# Altium project Sensor.PrjPcb
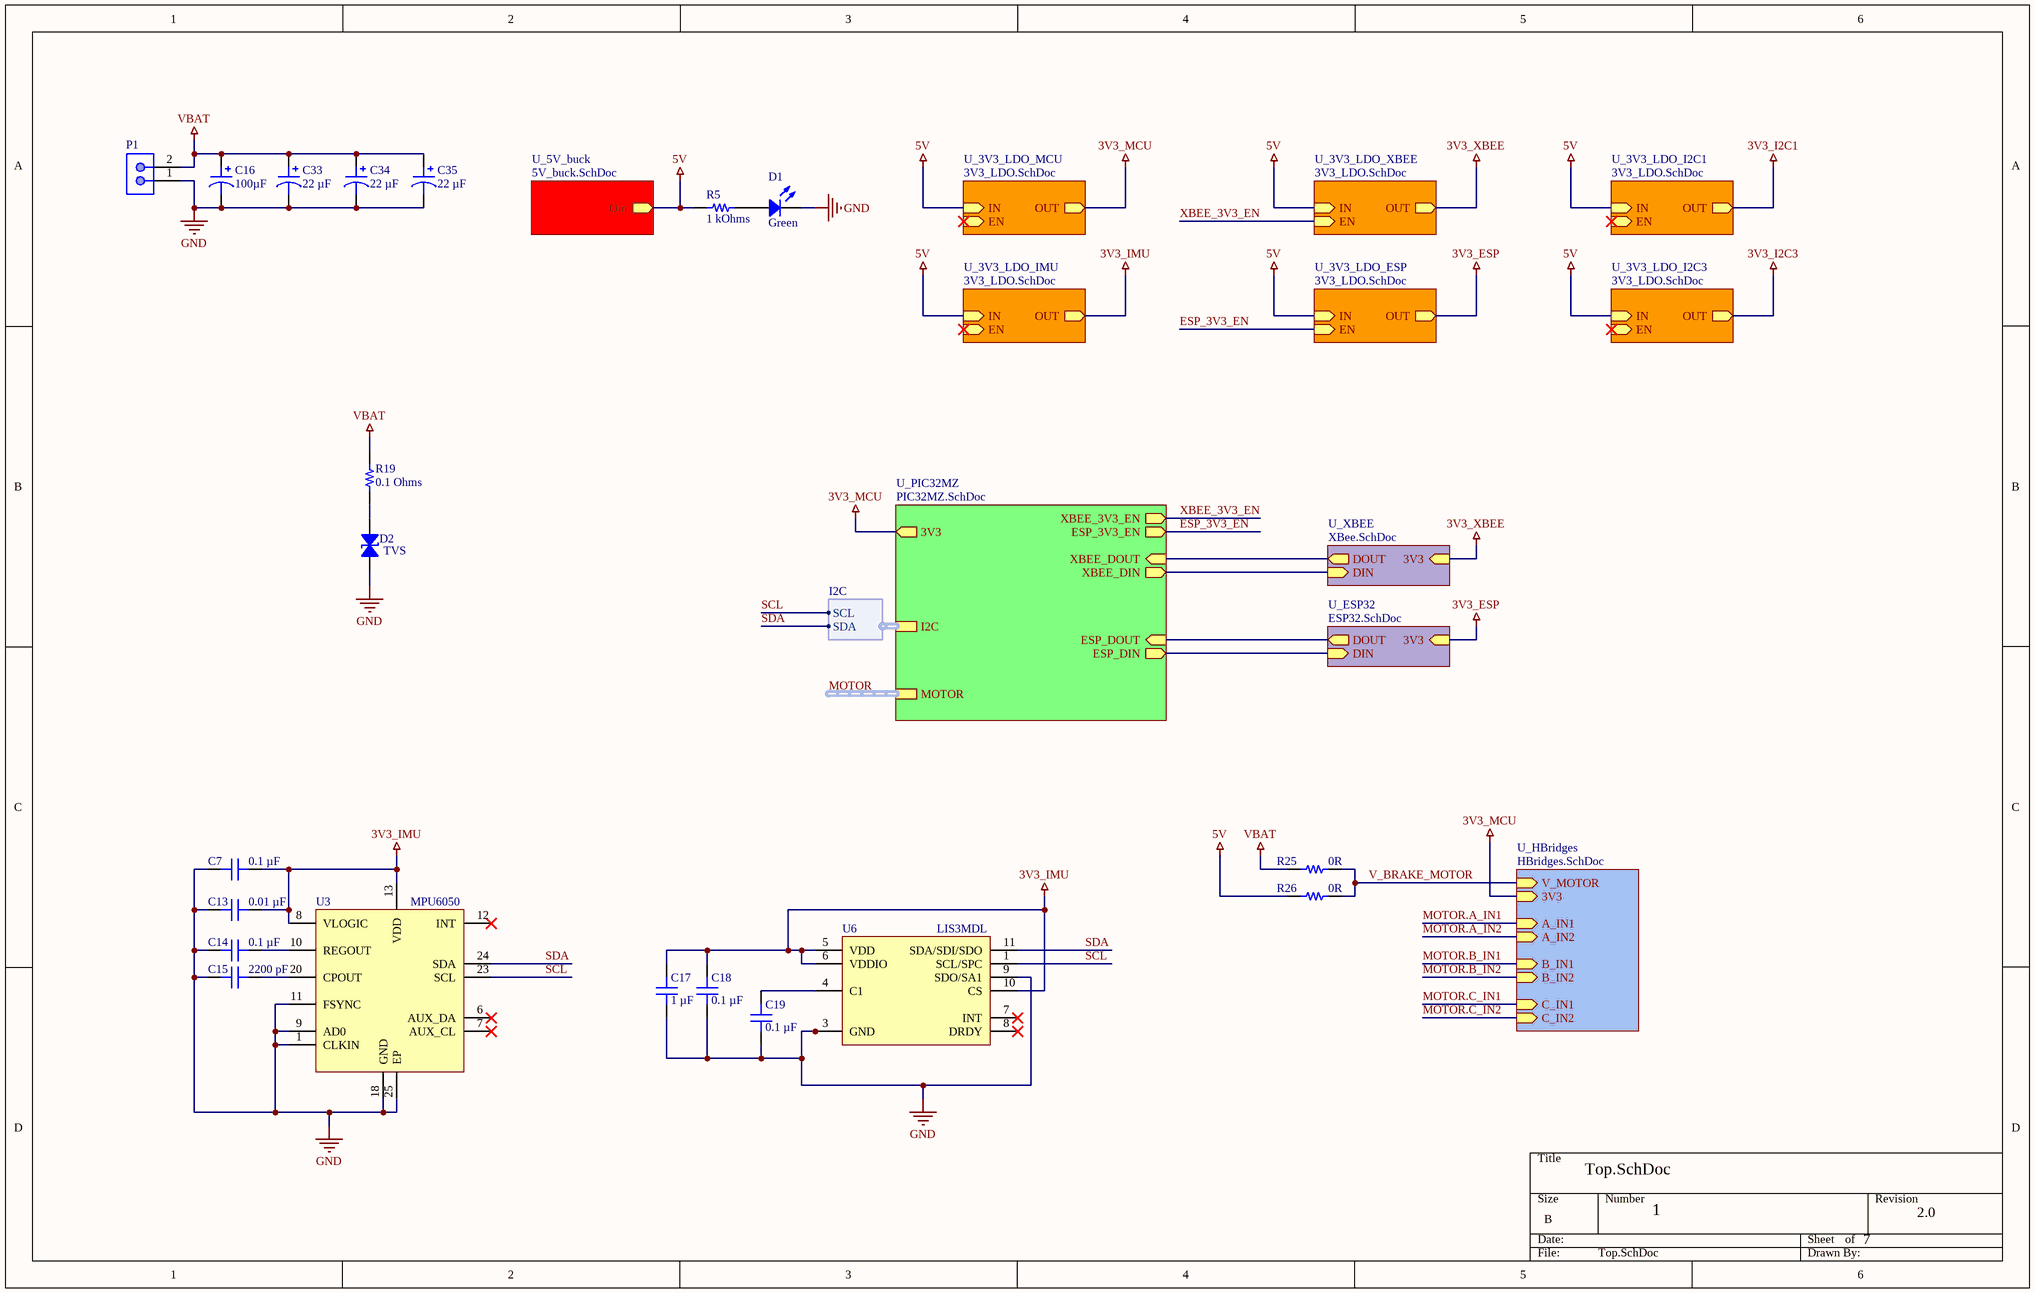
[diagram p0: Top.SchDoc]
ProjectRevision: 2.0
4 sheets, 44 parts. Net scope: hierarchical (ports join the sheet entries above them; power ports are global).
Board file: Sensor.PcbDoc
Sheets:
  Top.SchDoc
    U_5V_buck = 5V_buck.SchDoc
    U_HBridges = HBridges.SchDoc
    U_XBEE = XBee.SchDoc

## Sheet Top.SchDoc
size B; DocumentNumber: 1; SheetNumber: 1; SheetTotal: 7

### Parts
C7  0.1 µF  [CAP 0402_1005]
C13  0.01 µF  [CAP 0402_1005]
C14  0.1 µF  [CAP 0402_1005]
C15  2200 pF  [CAP 0402_1005]
C16  100µF  [CAP POL 2917_7343]
C17  1 µF  [CAP 0402_1005]
C18  0.1 µF  [CAP 0402_1005]
C19  0.1 µF  [CAP 0402_1005]
C33  22 µF  [CAP ALSMD 5.3MM H5.4MM]
C34  22 µF  [CAP ALSMD 5.3MM H5.4MM]
C35  22 µF  [CAP ALSMD 5.3MM H5.4MM]
D1  Green  [LED 0603_1608 GREEN]
D2  TVS  [DO214AC SMA]
P1  2 pin 2mm JST Male  [2pin - 2mm JST male]  (value not drawn)
R5  1 kOhms  [YAGEO RES 0402_1005]
R19  0.1 Ohms  [RES 1206_3216]
R25  0R  [RES 0603_1608]
R26  0R  [RES 0603_1608]
U3  MPU6050  [IC_MPU6050]
U6  LIS3MDL  [LGA12_ST]

### Sub-sheets
U_3V3_LDO_ESP = 3V3_LDO.SchDoc (file not in this document): OUT (out), IN (in), EN (in)
U_3V3_LDO_I2C1 = 3V3_LDO.SchDoc (file not in this document): OUT (out), IN (in), EN (in)
U_3V3_LDO_I2C3 = 3V3_LDO.SchDoc (file not in this document): OUT (out), IN (in), EN (in)
U_3V3_LDO_IMU = 3V3_LDO.SchDoc (file not in this document): OUT (out), IN (in), EN (in)
U_3V3_LDO_MCU = 3V3_LDO.SchDoc (file not in this document): OUT (out), IN (in), EN (in)
U_3V3_LDO_XBEE = 3V3_LDO.SchDoc (file not in this document): OUT (out), IN (in), EN (in)
U_5V_buck = 5V_buck.SchDoc: Out (out)
U_ESP32 = ESP32.SchDoc (file not in this document): 3V3 (in), DOUT (out), DIN (in)
U_HBridges = HBridges.SchDoc: A_IN1 (in), A_IN2 (in), B_IN1 (in), B_IN2 (in), C_IN1 (in), C_IN2 (in), 3V3 (in), V_MOTOR (in)
U_PIC32MZ = PIC32MZ.SchDoc (file not in this document): XBEE_DIN (out), XBEE_DOUT (in), I2C (harness I2C), MOTOR (harness MOTOR), ESP_DIN (out), ESP_DOUT (in), XBEE_3V3_EN (out), ESP_3V3_EN (out), 3V3 (out)
U_XBEE = XBee.SchDoc: 3V3 (in), DOUT (out), DIN (in)

### Harnesses
I2C: SCL, SDA

### Nets
3V3_ESP: sheet U_3V3_LDO_ESP/OUT, sheet U_ESP32/3V3
3V3_I2C1: sheet U_3V3_LDO_I2C1/OUT
3V3_I2C3: sheet U_3V3_LDO_I2C3/OUT
3V3_IMU: C7.1 C13.1 C17.1 C18.1 U3.8(VLOGIC) U3.13(VDD) U6.5(VDD) U6.6(VDDIO) U6.10(CS) ; sheet U_3V3_LDO_IMU/OUT
3V3_MCU: sheet U_PIC32MZ/3V3, sheet U_3V3_LDO_MCU/OUT, sheet U_HBridges/3V3
3V3_XBEE: sheet U_3V3_LDO_XBEE/OUT, sheet U_XBEE/3V3
5V: R5.1 R26.1 ; sheet U_5V_buck/Out, sheet U_3V3_LDO_MCU/IN, sheet U_3V3_LDO_XBEE/IN, sheet U_3V3_LDO_IMU/IN, sheet U_3V3_LDO_ESP/IN, sheet U_3V3_LDO_I2C1/IN, sheet U_3V3_LDO_I2C3/IN
GND: C7.2 C13.2 C14.2 C15.2 C16.2 C17.2 C18.2 C19.2 C33.2 C34.2 C35.2 D1.2 D2.2 P1.1 U3.1(CLKIN) U3.9(AD0) U3.11(FSYNC) U3.18(GND) U3.25(EP) U6.2(Reserved) U6.3(GND) U6.9(SDO/SA1) U6.12(Reserved)
VBAT: C16.1 C33.1 C34.1 C35.1 P1.2 R19.2 R25.1
ESP_3V3_EN: sheet U_PIC32MZ/ESP_3V3_EN, sheet U_3V3_LDO_ESP/EN
SCL: U3.23(SCL) U6.1(SCL/SPC) ; sheet U_PIC32MZ/I2C.SCL
SDA: U3.24(SDA) U6.11(SDA/SDI/SDO) ; sheet U_PIC32MZ/I2C.SDA
V_BRAKE_MOTOR: R25.2 R26.2 ; sheet U_HBridges/V_MOTOR
XBEE_3V3_EN: sheet U_PIC32MZ/XBEE_3V3_EN, sheet U_3V3_LDO_XBEE/EN
XBEE_DIN: sheet U_PIC32MZ/XBEE_DIN, sheet U_XBEE/DIN
XBEE_DOUT: sheet U_PIC32MZ/XBEE_DOUT, sheet U_XBEE/DOUT
NetC14_1: C14.1 U3.10(REGOUT)
NetC15_1: C15.1 U3.20(CPOUT)
NetC19_1: C19.1 U6.4(C1)
NetD1_1: D1.1 R5.2
NetD2_1: D2.1 R19.1
(unnamed): sheet U_PIC32MZ/ESP_DIN, sheet U_ESP32/DIN
(unnamed): sheet U_PIC32MZ/ESP_DOUT, sheet U_ESP32/DOUT

Not connected (* = marked no-connect by the designer): U3 6(AUX_DA)* 7(AUX_CL)* 12(INT)*; U6 7(INT)* 8(DRDY)*

### Buses and harness runs
harness MOTOR = sheet U_PIC32MZ/MOTOR

### Library data of the parts
C7 C14 C18 C19 = C0402C104K4RACAUTO: CAP CER 0.1UF 16V X7R 0402; manufacturer: KEMET; Tolerance: ±10%; Part Number: C0402C104K4RACAUTO; Value: 0.1 µF; Applications: Automotive, Bypass, Decoupling; Capacitance: 0.1 µF; componentlink1description: Datasheet; componentlink1url: https://api.kemet.com/component-edge/download/specsheet/C0402C104K4RACAUTO.pdf; componentlink2description: DigiKey Link; componentlink2url: https://www.digikey.com/en/products/detail/kemet/C0402C104K4RACAUTO/3314827; Device Package: 0402 (1005 Metric); lastupdated: 8/14/2022 9:05:51 PM; Lifecycle Status: Active; Minimum Order: 1; Mounting Type: Surface Mount, MLCC; Operating Temperature: -55°C ~ 125°C; Package / Case: 0402 (1005 Metric); packaging: TapeAndReel; partid: 3024; Part Status: Active; price: 0.01; Ratings: AEC-Q200; series: SMD Auto X7R; Size / Dimension: 0.039" L x 0.020" W (1.00mm x 0.50mm); Supplier 1: DigiKey; Supplier Part Number 1: 399-6828-1-ND; Temperature Coefficient: X7R; Thickness (Max): 0.022" (0.55mm); Voltage - Rated: 16V
C13 C15 C17 = C0402C104K4RACAUTO: CAP CER 0.1UF 16V X7R 0402; manufacturer: KEMET; Capacitance: 0.1 µF; Tolerance: ±10%; Part Number: C0402C104K4RACAUTO; Applications: Automotive, Bypass, Decoupling; componentlink1description: Datasheet; componentlink1url: https://api.kemet.com/component-edge/download/specsheet/C0402C104K4RACAUTO.pdf; componentlink2description: DigiKey Link; componentlink2url: https://www.digikey.com/en/products/detail/kemet/C0402C104K4RACAUTO/3314827; Device Package: 0402 (1005 Metric); lastupdated: 8/14/2022 9:05:51 PM; Lifecycle Status: Active; Minimum Order: 1; Mounting Type: Surface Mount, MLCC; Operating Temperature: -55°C ~ 125°C; Package / Case: 0402 (1005 Metric); packaging: TapeAndReel; partid: 3024; Part Status: Active; price: 0.01; Ratings: AEC-Q200; series: SMD Auto X7R; Size / Dimension: 0.039" L x 0.020" W (1.00mm x 0.50mm); Supplier 1: DigiKey; Supplier Part Number 1: 399-6828-1-ND; Temperature Coefficient: X7R; Thickness (Max): 0.022" (0.55mm); Voltage - Rated: 16V
  C13: Value: 0.01 µF
  C15: Value: 2200 pF
  C17: Value: 1 µF
C16 = 293D107X0020E2TE3: CAP TANT 100UF 20% 20V 2917; Manufacturer: Vishay Sprague; Manufacturer Size Code: E; ESR (Equivalent Series Resistance): 500mOhm; Type: Molded; Part Number: 293D107X0020E2TE3; Value: 100µF; Capacitance: 100µF; ComponentLink1Description: Datasheet; ComponentLink1URL: http://www.vishay.com/docs/40002/293d.pdf; ComponentLink2Description: DigiKey Link; ComponentLink2URL: http://digikey.com/product-detail/en/vishay-sprague/293D107X0020E2TE3/718-293D107X0020E2TE3CT-ND/10507022; Device Package: 2917 (7343 Metric); Features: General Purpose; Height - Seated (Max): 0.170" (4.32mm); LastUpdated: 13-Aug-20 10:43:35 AM; Lifecycle Status: Active; Minimum Order: 1; Mounting Type: Surface Mount; Operating Temperature: -55°C ~ 125°C; Package / Case: 2917 (7343 Metric); Packaging: TapeAndReel; PartId: 1360; Part Status: Active; Price: 0.70; Series: TANTAMOUNT®, 293D; Size / Dimension: 0.287" L x 0.169" W (7.30mm x 4.30mm); Supplier 1: DigiKey; Supplier Part Number 1: 718-293D107X0020E2TE3CT-ND; Tolerance: ±20%
C33-C35 = EMZA350ADA220ME61G: CAP ALUM 22UF 20% 35V SMD; manufacturer: United Chemi-Con; Impedance: 700 mOhms; Lifetime @ Temp.: 2000 Hrs @ 105°C; Polarization: Polar; Ripple Current @ High Frequency: 160 mA @ 100 kHz; Ripple Current @ Low Frequency: 64 mA @ 120 Hz; Surface Mount Land Size: 0.209" L x 0.209" W (5.30mm x 5.30mm); Part Number: EMZA350ADA220ME61G; Applications: Automotive; Capacitance: 22 µF; componentlink1description: Datasheet; componentlink1url: http://www.chemi-con.co.jp/cgi-bin/CAT_DB/SEARCH/cat_db_al.cgi?e=e&j=p&pdfname=mza; componentlink2description: DigiKey Link; componentlink2url: https://www.digikey.com/en/products/detail/united-chemi-con/EMZA350ADA220ME61G/757201; Device Package: Radial, Can - SMD; Height - Seated (Max): 0.240" (6.10mm); lastupdated: 6/3/2024 7:53:11 PM; Lifecycle Status: Active; Minimum Order: 1; Mounting Type: Surface Mount; Operating Temperature: -55°C ~ 105°C; Package / Case: Radial, Can - SMD; packaging: TapeAndReel; partid: 27195; Part Status: Active; price: 0.12; Ratings: AEC-Q200; series: Alchip™- MZA; Size / Dimension: 0.197" Dia (5.00mm); Supplier 1: DigiKey; Supplier Part Number 1: 565-2556-1-ND; Tolerance: ±20%; value: 22 µF; Voltage - Rated: 35 V
D1 = XZCDGK53W-8VF: 1.6X0.8MM LC GREEN PIXSOLED DOME; Manufacturer: SunLED; Configuration: Independent; Current - Test: 2mA; Lens Color: Colorless; Lens Size: 0.35mm Dia; Lens Style: Round with Domed Top; Lens Transparency: Clear; Millicandela Rating: 417mcd; Viewing Angle: 60°; Voltage - Forward (Vf) (Typ): 2.65V; Wavelength - Dominant: 525nm; Wavelength - Peak: 515nm; Part Number: XZCDGK53W-8VF; Color: Green; ComponentLink1Description: Datasheet; ComponentLink1URL: https://www.sunledusa.com/products/spec/XZCDGK53W-8VF.pdf; ComponentLink2Description: DigiKey Link; ComponentLink2URL: http://digikey.com/product-detail/en/sunled/XZCDGK53W-8VF/1497-XZCDGK53W-8VFCT-ND/10449792; Device Package: 0603 (1608 Metric); Height (Max): 1.10mm; LastUpdated: 21-Jan-20 3:12:09 AM; Lifecycle Status: Active; Minimum Order: 1; Mounting Type: Surface Mount; Package / Case: 0603 (1608 Metric); Packaging: Unknown; PartId: 938; Part Status: Active; Price: 0.18; Series: Ultra Low Current; Size / Dimension: 1.60mm L x 0.80mm W; Supplier 1: DigiKey; Supplier Part Number 1: 1497-XZCDGK53W-8VFCT-ND; Supplier Device Package: 2-SMD; Value: Green
D2 = SMAJ110CA-E3/61: TVS DIODE 110V 177V DO214AC; Manufacturer: Vishay Semiconductor Diodes Division; Bidirectional Channels: 1; Current - Peak Pulse (10/1000µs): 1.7A; Power Line Protection: No; Power - Peak Pulse: 300W; Type: Zener; Voltage - Breakdown (Min): 122V; Part Number: SMAJ110CA-E3/61; Applications: General Purpose; ComponentLink1Description: Datasheet; ComponentLink1URL: http://www.vishay.com/docs/88390/smaj50a.pdf; ComponentLink2Description: DigiKey Link; ComponentLink2URL: http://digikey.com/product-detail/en/vishay-semiconductor-diodes-division/SMAJ110CA-E3-61/SMAJ110CA-E3-61GICT-ND/3847618; LastUpdated: 6/3/2024 8:21:23 PM; Lifecycle Status: Active; Minimum Order: 1; Mounting Type: Surface Mount; Operating Temperature: -55°C ~ 150°C (TJ); Package / Case: DO-214AC, SMA; Packaging: TapeAndReel; PartId: 7836; Part Status: Active; Price: 0.10; Series: TransZorb®; Supplier 1: DigiKey; Supplier Part Number 1: SMAJ110CA-E3/61GICT-ND; Supplier Device Package: DO-214AC (SMA); Voltage - Clamping (Max) @ Ipp: 177V; Voltage - Reverse Standoff (Typ): 110V
R5 = RC0402FR-071KL: RES 1K OHM 1% 1/16W 0402; Manufacturer: Yageo; Power (Watts): 0.063W, 1/16W; Temperature Coefficient: ±100ppm/°C; Part Number: RC0402FR-071KL; Value: 1 kOhms; ComponentLink1Description: Datasheet; ComponentLink1URL: https://www.yageo.com/upload/media/product/productsearch/datasheet/rchip/PYu-RC_Group_51_RoHS_L_10.pdf; ComponentLink2Description: DigiKey Link; ComponentLink2URL: https://www.digikey.com/en/products/detail/yageo/RC0402FR-071KL/726513; Composition: Thick Film; Device Package: 0402 (1005 Metric); Features: Moisture Resistant; Height - Seated (Max): 0.016" (0.40mm); LastUpdated: 7/25/2024 9:18:11 AM; Lifecycle Status: Active; Minimum Order: 1; Number of Terminations: 2; Operating Temperature: -55°C ~ 155°C; Package / Case: 0402 (1005 Metric); Packaging: CutTape; PartId: 17596; Part Status: Active; Price: 0.01; Resistance: 1 kOhms; Series: RC_L; Size / Dimension: 0.039" L x 0.020" W (1.00mm x 0.50mm); Supplier 1: DigiKey; Supplier Part Number 1: 311-1.00KLRCT-ND; Supplier Device Package: 0402; Tolerance: ±1%
R19 = WSL120600000ZEA9: RES 0 OHM JUMPER 1206; Manufacturer: Vishay Dale; Resistance: 0 Ohms; Temperature Coefficient: ±3900ppm/°C; Value: 0 Ohms; Part Number: WSL120600000ZEA9; ComponentLink1Description: Datasheet; ComponentLink1URL: http://www.vishay.com/docs/30192/wsl-9.pdf; ComponentLink2Description: DigiKey Link; ComponentLink2URL: https://www.digikey.com/en/products/detail/vishay-dale/WSL120600000ZEA9/7423219; Composition: Metal Element; Device Package: 1206 (3216 Metric); Height - Seated (Max): 0.035" (0.89mm); LastUpdated: 2/9/2024 8:54:11 PM; Lifecycle Status: Active; Minimum Order: 1; Number of Terminations: 2; Operating Temperature: -65°C ~ 170°C; Package / Case: 1206 (3216 Metric); Packaging: TapeAndReel; PartId: 35636; Part Status: Active; Price: 0.31; Series: WSL; Size / Dimension: 0.126" L x 0.063" W (3.20mm x 1.60mm); Supplier 1: DigiKey; Supplier Part Number 1: 541-3929-1-ND; Supplier Device Package: 1206; Tolerance: Jumper
R25 R26 = WSTC0603RLR004FNR: 2T WSTC0603 0.33W 100PPM 4 MOHM; Manufacturer: Littelfuse Inc.; Power (Watts): 0.333W, 1/3W; Resistance: 4 mOhms; Temperature Coefficient: ±100ppm/°C; Tolerance: ±1%; Part Number: WSTC0603RLR004FNR; Value: 0R; ComponentLink1Description: Datasheet; ComponentLink1URL: https://mm.digikey.com/Volume0/opasdata/d220001/medias/docus/4903/WSTC_Series_3-17-23.pdf; ComponentLink2Description: DigiKey Link; ComponentLink2URL: https://www.digikey.com/en/products/detail/littelfuse-inc/WSTC0603RLR004FNR/18795246; Composition: Metal Foil; Device Package: 0603 (1608 Metric); Features: Current Sense, High Voltage; Height - Seated (Max): 0.022" (0.55mm); LastUpdated: 2/9/2024 8:40:30 PM; Lifecycle Status: Active; Minimum Order: 1; Number of Terminations: 2; Operating Temperature: -55°C ~ 155°C; Package / Case: 0603 (1608 Metric); Packaging: TapeAndReel; PartId: 81875; Price: 0.10; Series: WSTC; Size / Dimension: 0.063" L x 0.031" W (1.60mm x 0.80mm); Supplier 1: DigiKey; Supplier Part Number 1: 18-WSTC0603RLR004FNRCT-ND; Supplier Device Package: 0603
U6 = LIS3MDL: Magnetometer

## Sheet 5V_buck.SchDoc
size B; DocumentNumber: 3; SheetNumber: 4; SheetTotal: 7
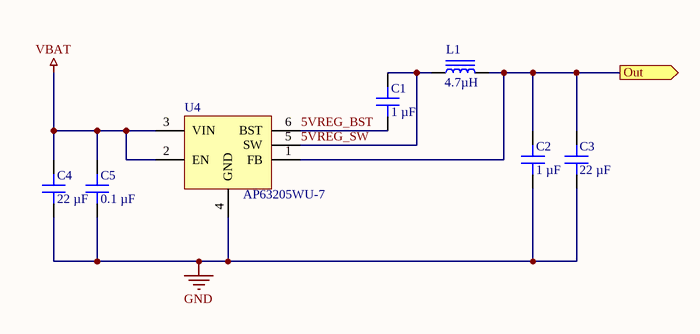
[diagram p1: 5V_buck.SchDoc]

### Parts
C1  1 µF  [CAP 0402_1005]
C2  1 µF  [CAP 0402_1005]
C3  22 µF  [CAP 0402_1005]
C4  22 µF  [CAP 0603_1608]
C5  0.1 µF  [CAP 0402_1005]
L1  4.7µH  [IND 1008_2520]
U4  AP63205WU-7  [TSOT-26-6 - 3.2mm]

### Ports
Out (out)

### Nets
5V: C2.2 C3.2 L1.2 U4.1(FB) ; port Out
GND: C2.1 C3.1 C4.1 C5.1 U4.4(GND)
VBAT: C4.2 C5.2 U4.2(EN) U4.3(VIN)
5VREG_BST: C1.1 U4.6(BST)
5VREG_SW: C1.2 L1.1 U4.5(SW)

### Library data of the parts
C1-C3 = C0402C104K4RACAUTO: as C13 on sheet Top; Part Number: C0402C104K4RACAUTO; Applications: Automotive, Bypass, Decoupling; componentlink1description: Datasheet; componentlink1url: https://api.kemet.com/component-edge/download/specsheet/C0402C104K4RACAUTO.pdf; componentlink2description: DigiKey Link; componentlink2url: https://www.digikey.com/en/products/detail/kemet/C0402C104K4RACAUTO/3314827; Device Package: 0402 (1005 Metric); lastupdated: 8/14/2022 9:05:51 PM; Lifecycle Status: Active; Minimum Order: 1; Mounting Type: Surface Mount, MLCC; Operating Temperature: -55°C ~ 125°C; Package / Case: 0402 (1005 Metric); packaging: TapeAndReel; partid: 3024; Part Status: Active; price: 0.01; Ratings: AEC-Q200; series: SMD Auto X7R; Size / Dimension: 0.039" L x 0.020" W (1.00mm x 0.50mm); Supplier 1: DigiKey; Supplier Part Number 1: 399-6828-1-ND; Temperature Coefficient: X7R; Thickness (Max): 0.022" (0.55mm); Voltage - Rated: 16V
  C1 C2: Value: 1 µF
  C3: Value: 22 µF
C4 = C0603B476M007T: CAP CER 47UF 6.3V X5R 0603; manufacturer: Holy Stone Enterprise Co., Ltd.; Capacitance: 47 µF; Tolerance: ±20%; Part Number: C0603B476M007T; Value: 22 µF; Applications: SMPS Filtering; componentlink1description: Datasheet; componentlink1url: https://media.digikey.com/pdf/Data%20Sheets/Holy%20Stone/HCC_Series_DS.pdf; componentlink2description: DigiKey Link; componentlink2url: https://www.digikey.com/en/products/detail/holy-stone-enterprise-co-ltd/C0603B476M007T/16895203; Device Package: 0603 (1608 Metric); lastupdated: 2/9/2024 8:09:41 PM; Lifecycle Status: Active; Minimum Order: 1; Mounting Type: Surface Mount, MLCC; Operating Temperature: -55°C ~ 85°C; Package / Case: 0603 (1608 Metric); packaging: TapeAndReel; partid: 48531; Part Status: Active; price: 0.12; series: HCC; Size / Dimension: 0.063" L x 0.031" W (1.60mm x 0.80mm); Supplier 1: DigiKey; Supplier Part Number 1: 4587-C0603B476M007TCT-ND; Temperature Coefficient: X5R; Thickness (Max): 0.039" (1.00mm); Voltage - Rated: 6.3V
C5 = C0402C104K4RACAUTO: as C7 on sheet Top; Part Number: C0402C104K4RACAUTO; Value: 0.1 µF; Applications: Automotive, Bypass, Decoupling; Capacitance: 0.1 µF; componentlink1description: Datasheet; componentlink1url: https://api.kemet.com/component-edge/download/specsheet/C0402C104K4RACAUTO.pdf; componentlink2description: DigiKey Link; componentlink2url: https://www.digikey.com/en/products/detail/kemet/C0402C104K4RACAUTO/3314827; Device Package: 0402 (1005 Metric); lastupdated: 8/14/2022 9:05:51 PM; Lifecycle Status: Active; Minimum Order: 1; Mounting Type: Surface Mount, MLCC; Operating Temperature: -55°C ~ 125°C; Package / Case: 0402 (1005 Metric); packaging: TapeAndReel; partid: 3024; Part Status: Active; price: 0.01; Ratings: AEC-Q200; series: SMD Auto X7R; Size / Dimension: 0.039" L x 0.020" W (1.00mm x 0.50mm); Supplier 1: DigiKey; Supplier Part Number 1: 399-6828-1-ND; Temperature Coefficient: X7R; Thickness (Max): 0.022" (0.55mm); Voltage - Rated: 16V
L1 = MLP2520S4R7ST0S1: FIXED IND 4.7UH 1A 110 MOHM SMD; Manufacturer: TDK Corporation; DC Resistance (DCR): 143mOhm Max; Inductance Frequency - Test: 2MHz; Material - Core: Ferrite; Shielding: Shielded; Tolerance: ±20%; Type: Multilayer; Part Number: MLP2520S4R7ST0S1; ComponentLink1Description: Datasheet; ComponentLink1URL: https://product.tdk.com/info/en/catalog/datasheets/inductor_commercial_power_mlp2520_en.pdf?ref_disty=digikey; ComponentLink2Description: DigiKey Link; ComponentLink2URL: http://digikey.com/product-detail/en/tdk-corporation/MLP2520S4R7ST0S1/445-6378-1-ND/2465705; Current Rating (Amps): 1A; Device Package: 1008 (2520 Metric); Height - Seated (Max): 0.039" (1.00mm); Inductance: 4.7µH; LastUpdated: 13-Aug-20 11:03:40 AM; Lifecycle Status: Active; Minimum Order: 1; Mounting Type: Surface Mount; Operating Temperature: -40°C ~ 125°C; Package / Case: 1008 (2520 Metric); Packaging: TapeAndReel; PartId: 3467; Part Status: Active; Price: 0.14; Series: MLP; Size / Dimension: 0.098" L x 0.079" W (2.50mm x 2.00mm); Supplier 1: DigiKey; Supplier Part Number 1: 445-6378-1-ND; Supplier Device Package: 1008 (2520 Metric); Value: 4.7µH
U4 = AP63205WU-7: 5V fixed step down Buck

## Sheet HBridges.SchDoc
size B; DocumentNumber: 5; SheetNumber: 5; SheetTotal: 7
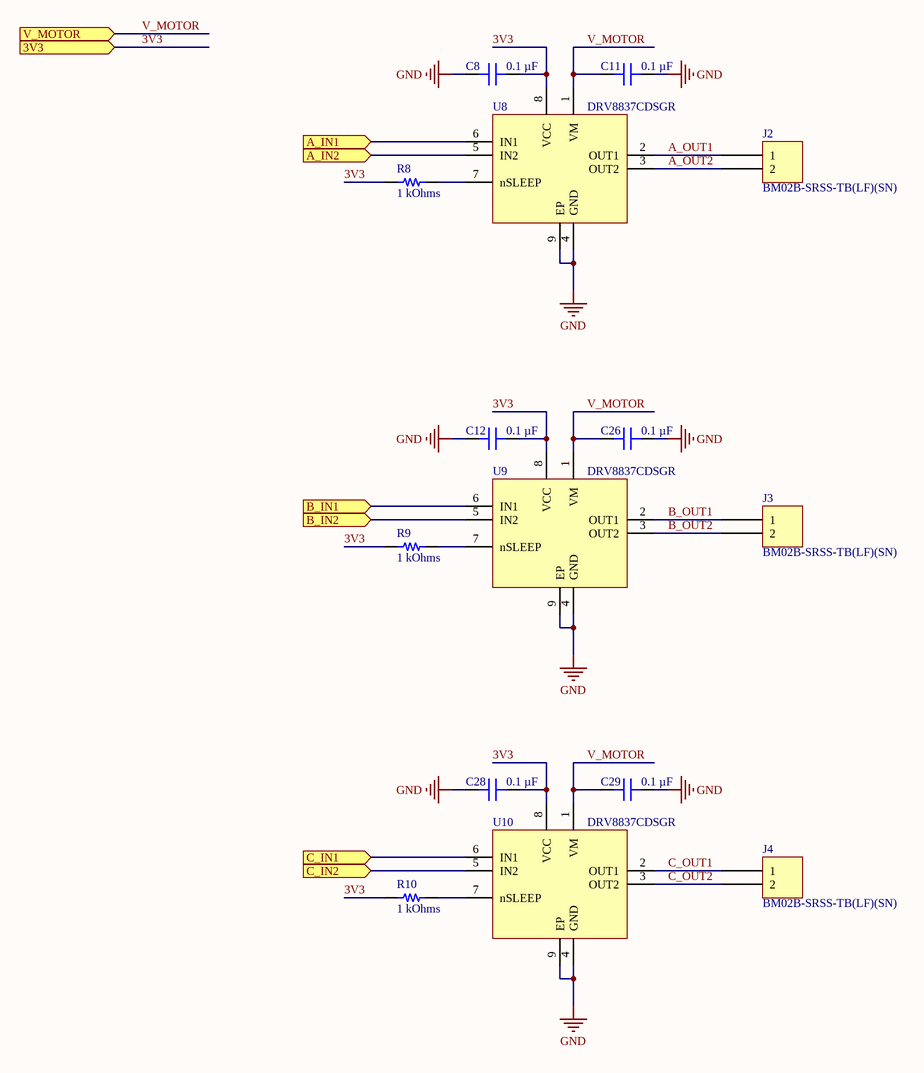
[diagram p2: HBridges.SchDoc]

### Parts
C8  0.1 µF  [CAP 0402_1005]
C11  0.1 µF  [CAP 0402_1005]
C12  0.1 µF  [CAP 0402_1005]
C26  0.1 µF  [CAP 0402_1005]
C28  0.1 µF  [CAP 0402_1005]
C29  0.1 µF  [CAP 0402_1005]
J2  BM02B-SRSS-TB(LF)(SN)  [JST BM02B-SRSS-TB]
J3  BM02B-SRSS-TB(LF)(SN)  [JST BM02B-SRSS-TB]
J4  BM02B-SRSS-TB(LF)(SN)  [JST BM02B-SRSS-TB]
R8  1 kOhms  [YAGEO RES 0402_1005]
R9  1 kOhms  [YAGEO RES 0402_1005]
R10  1 kOhms  [YAGEO RES 0402_1005]
U8  DRV8837CDSGR  [SON50P200X200X80-9N]
U9  DRV8837CDSGR  [SON50P200X200X80-9N]
U10  DRV8837CDSGR  [SON50P200X200X80-9N]

### Ports
3V3 (in), A_IN1 (in), A_IN2 (in), B_IN1 (in), B_IN2 (in), C_IN1 (in), C_IN2 (in), V_MOTOR (in)

### Nets
3V3: C8.1 C12.1 C28.1 R8.1 R9.1 R10.1 U8.8(VCC) U9.8(VCC) U10.8(VCC) ; port 3V3  [project net 3V3_MCU]
GND: C8.2 C11.1 C12.2 C26.1 C28.2 C29.1 U8.4(GND) U8.9(EP) U9.4(GND) U9.9(EP) U10.4(GND) U10.9(EP)
A_OUT1: J2.1 U8.2(OUT1)
A_OUT2: J2.2 U8.3(OUT2)
B_OUT1: J3.1 U9.2(OUT1)
B_OUT2: J3.2 U9.3(OUT2)
C_OUT1: J4.1 U10.2(OUT1)
C_OUT2: J4.2 U10.3(OUT2)
MOTOR.A_IN1: U8.6(IN1) ; port A_IN1
MOTOR.A_IN2: U8.5(IN2) ; port A_IN2
MOTOR.B_IN1: U9.6(IN1) ; port B_IN1
MOTOR.B_IN2: U9.5(IN2) ; port B_IN2
MOTOR.C_IN1: U10.6(IN1) ; port C_IN1
MOTOR.C_IN2: U10.5(IN2) ; port C_IN2
V_MOTOR: C11.2 C26.2 C29.2 U8.1(VM) U9.1(VM) U10.1(VM) ; port V_MOTOR  [project net V_BRAKE_MOTOR]
NetR8_2: R8.2 U8.7(nSLEEP)
NetR9_2: R9.2 U9.7(nSLEEP)
NetR10_2: R10.2 U10.7(nSLEEP)

### Library data of the parts
C8 C11 C12 C26 C28 C29 = C0402C104K4RACAUTO: as C7 on sheet Top; Part Number: C0402C104K4RACAUTO; Value: 0.1 µF; Applications: Automotive, Bypass, Decoupling; Capacitance: 0.1 µF; componentlink1description: Datasheet; componentlink1url: https://api.kemet.com/component-edge/download/specsheet/C0402C104K4RACAUTO.pdf; componentlink2description: DigiKey Link; componentlink2url: https://www.digikey.com/en/products/detail/kemet/C0402C104K4RACAUTO/3314827; Device Package: 0402 (1005 Metric); lastupdated: 8/14/2022 9:05:51 PM; Lifecycle Status: Active; Minimum Order: 1; Mounting Type: Surface Mount, MLCC; Operating Temperature: -55°C ~ 125°C; Package / Case: 0402 (1005 Metric); packaging: TapeAndReel; partid: 3024; Part Status: Active; price: 0.01; Ratings: AEC-Q200; series: SMD Auto X7R; Size / Dimension: 0.039" L x 0.020" W (1.00mm x 0.50mm); Supplier 1: DigiKey; Supplier Part Number 1: 399-6828-1-ND; Temperature Coefficient: X7R; Thickness (Max): 0.022" (0.55mm); Voltage - Rated: 16V
J2-J4 = BM02B-SRSS-TB(LF)(SN): CONN HEADER SMD 2POS 1MM; Manufacturer: JST Sales America Inc.; Current Rating (Amps): 0.7A; Material Flammability Rating: UL94 V-0; Number of Positions: 2; Number of Positions Loaded: All; Pitch - Mating: 0.039" (1.00mm); Shrouding: Shrouded - 4 Wall; Style: Board to Cable/Wire; Voltage Rating: 50V; Part Number: BM02B-SRSS-TB(LF)(SN); ComponentLink1Description: Datasheet; ComponentLink1URL: http://www.jst-mfg.com/product/pdf/eng/eSR.pdf; ComponentLink2Description: DigiKey Link; ComponentLink2URL: http://digikey.com/product-detail/en/jst-sales-america-inc/BM02B-SRSS-TB-LF-SN/455-1788-1-ND/926859; Connector Type: Header; Contact Finish - Mating: Tin; Contact Finish - Post: Tin; Contact Material: Copper Alloy; Contact Shape: Square; Contact Type: Male Pin; Fastening Type: Push-Pull; Features: Solder Retention; Insulation Color: Natural; Insulation Height: 0.167" (4.25mm); Insulation Material: Polyamide (PA), Nylon; LastUpdated: 1/12/2020 10:11:04 PM; Lifecycle Status: Active; Minimum Order: 1; Mounting Type: Surface Mount; Number of Rows: 1; Operating Temperature: -25°C ~ 85°C; Packaging: TapeAndReel; PartId: 12; Part Status: Active; Price: 0.22; Series: SR; Supplier 1: DigiKey; Supplier Part Number 1: 455-1788-1-ND; Termination: Solder
R8-R10 = RC0402FR-071KL: as R5 on sheet Top; Part Number: RC0402FR-071KL; Value: 1 kOhms; ComponentLink1Description: Datasheet; ComponentLink1URL: https://www.yageo.com/upload/media/product/productsearch/datasheet/rchip/PYu-RC_Group_51_RoHS_L_10.pdf; ComponentLink2Description: DigiKey Link; ComponentLink2URL: https://www.digikey.com/en/products/detail/yageo/RC0402FR-071KL/726513; Composition: Thick Film; Device Package: 0402 (1005 Metric); Features: Moisture Resistant; Height - Seated (Max): 0.016" (0.40mm); LastUpdated: 7/25/2024 9:18:11 AM; Lifecycle Status: Active; Minimum Order: 1; Number of Terminations: 2; Operating Temperature: -55°C ~ 155°C; Package / Case: 0402 (1005 Metric); Packaging: CutTape; PartId: 17596; Part Status: Active; Price: 0.01; Resistance: 1 kOhms; Series: RC_L; Size / Dimension: 0.039" L x 0.020" W (1.00mm x 0.50mm); Supplier 1: DigiKey; Supplier Part Number 1: 311-1.00KLRCT-ND; Supplier Device Package: 0402; Tolerance: ±1%
U8-U10 = DRV8837CDSGR: 11-V, 1-A H-bridge motor driver 8-WSON -40 to 85; MF: Texas Instruments; Mouser-Purchase-URL: https://snapeda.com/shop?store=Mouser&id=617854; Value: *; DigiKey-Purchase-URL: https://snapeda.com/shop?store=DigiKey&id=617854; Package: WSON-8 Texas Instruments; Texas_Instruments-Purchase-URL: https://snapeda.com/shop?store=Texas+Instruments&id=617854; Price: None; MP: DRV8837CDSGR; SnapEDA_Link: https://www.snapeda.com/parts/DRV8837CDSGR/Texas%20Instruments/view-part/617854/?ref=snap; Availability: Good

## Sheet XBee.SchDoc
size B; DocumentNumber: 7; SheetNumber: 7; SheetTotal: 7
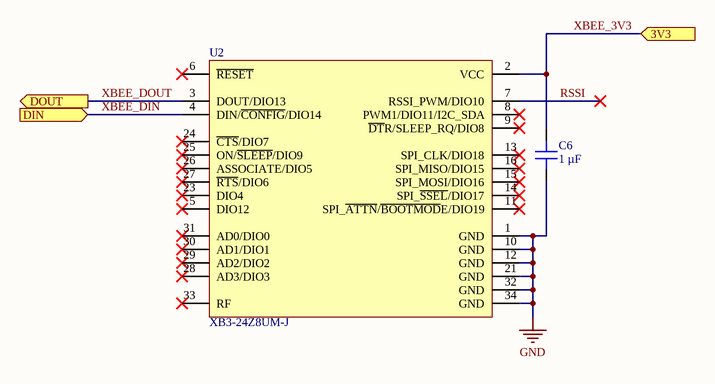
[diagram p3: XBee.SchDoc]

### Parts
C6  1 µF  [CAP 0402_1005]
U2  XB3-24Z8UM-J  [XCVR_XB3-24Z8UM-J]

### Ports
3V3 (in), DIN (in), DOUT (out)

### Nets
GND: C6.2 U2.1(GND) U2.10(GND) U2.12(GND) U2.21(GND) U2.32(GND) U2.34(GND)
XBEE_3V3: C6.1 U2.2(VCC) ; port 3V3  [project net 3V3_XBEE]
RSSI: U2.7(RSSI_PWM/DIO10)
XBEE_DIN: U2.4(DIN/~{CONFIG}/DIO14) ; port DIN
XBEE_DOUT: U2.3(DOUT/DIO13) ; port DOUT

Not connected (* = marked no-connect by the designer): U2 5(DIO12)* 6(~{RESET})* 8(PWM1/DIO11/I2C_SDA)* 9(~{DT}R/SLEEP_RQ/DIO8)* 11(SPI_~{ATTN}/~{BOOTMOD}E/DIO19)* 13(SPI_CLK/DIO18)* 14(SPI_~{SSEL}/DIO17)* 15(SPI_MOSI/DIO16)* 16(SPI_MISO/DIO15)* 23(DIO4)* 24(~{CTS}/DIO7)* 25(ON/~{SLEEP}/DIO9)* 26(ASSOCIATE/DIO5)* 27(~{RTS}/DIO6)* 28(AD3/DIO3)* 29(AD2/DIO2)* 30(AD1/DIO1)* 31(AD0/DIO0)* 33(RF)*

### Library data of the parts
C6 = C0402C104K4RACAUTO: as C13 on sheet Top; Part Number: C0402C104K4RACAUTO; Value: 1 µF; Applications: Automotive, Bypass, Decoupling; componentlink1description: Datasheet; componentlink1url: https://api.kemet.com/component-edge/download/specsheet/C0402C104K4RACAUTO.pdf; componentlink2description: DigiKey Link; componentlink2url: https://www.digikey.com/en/products/detail/kemet/C0402C104K4RACAUTO/3314827; Device Package: 0402 (1005 Metric); lastupdated: 8/14/2022 9:05:51 PM; Lifecycle Status: Active; Minimum Order: 1; Mounting Type: Surface Mount, MLCC; Operating Temperature: -55°C ~ 125°C; Package / Case: 0402 (1005 Metric); packaging: TapeAndReel; partid: 3024; Part Status: Active; price: 0.01; Ratings: AEC-Q200; series: SMD Auto X7R; Size / Dimension: 0.039" L x 0.020" W (1.00mm x 0.50mm); Supplier 1: DigiKey; Supplier Part Number 1: 399-6828-1-ND; Temperature Coefficient: X7R; Thickness (Max): 0.022" (0.55mm); Voltage - Rated: 16V
U2 = XB3-24Z8UM-J: 802.15.4 Zigbee Transceiver Module 2.4GHz Antenna Not Included, U.FL Surface Mount; MF: Digi International; Availability: Unavailable; MP: XB3-24Z8UM-J; Value: *; SnapEDA_Link: https://www.snapeda.com/parts/XB3-24Z8UM-J/Digi%20International/view-part/2762908/?ref=snap; Price: None; Package: SMD-34 Digi International

## Nets that join several sheets
5V: Top (R5.1 R26.1), 5V_buck (C2.2 C3.2 L1.2 U4.1)
GND: Top (23 pins), 5V_buck (5 pins), HBridges (12 pins), XBee (7 pins)
VBAT: Top (7 pins), 5V_buck (C4.2 C5.2 U4.2 U4.3)
V_BRAKE_MOTOR: Top (R25.2 R26.2), HBridges (6 pins)

## Assembly variants
Main: not fitted R25 R26